# EAGLE design PGTN005_filter (EAGLE 9.6.0)
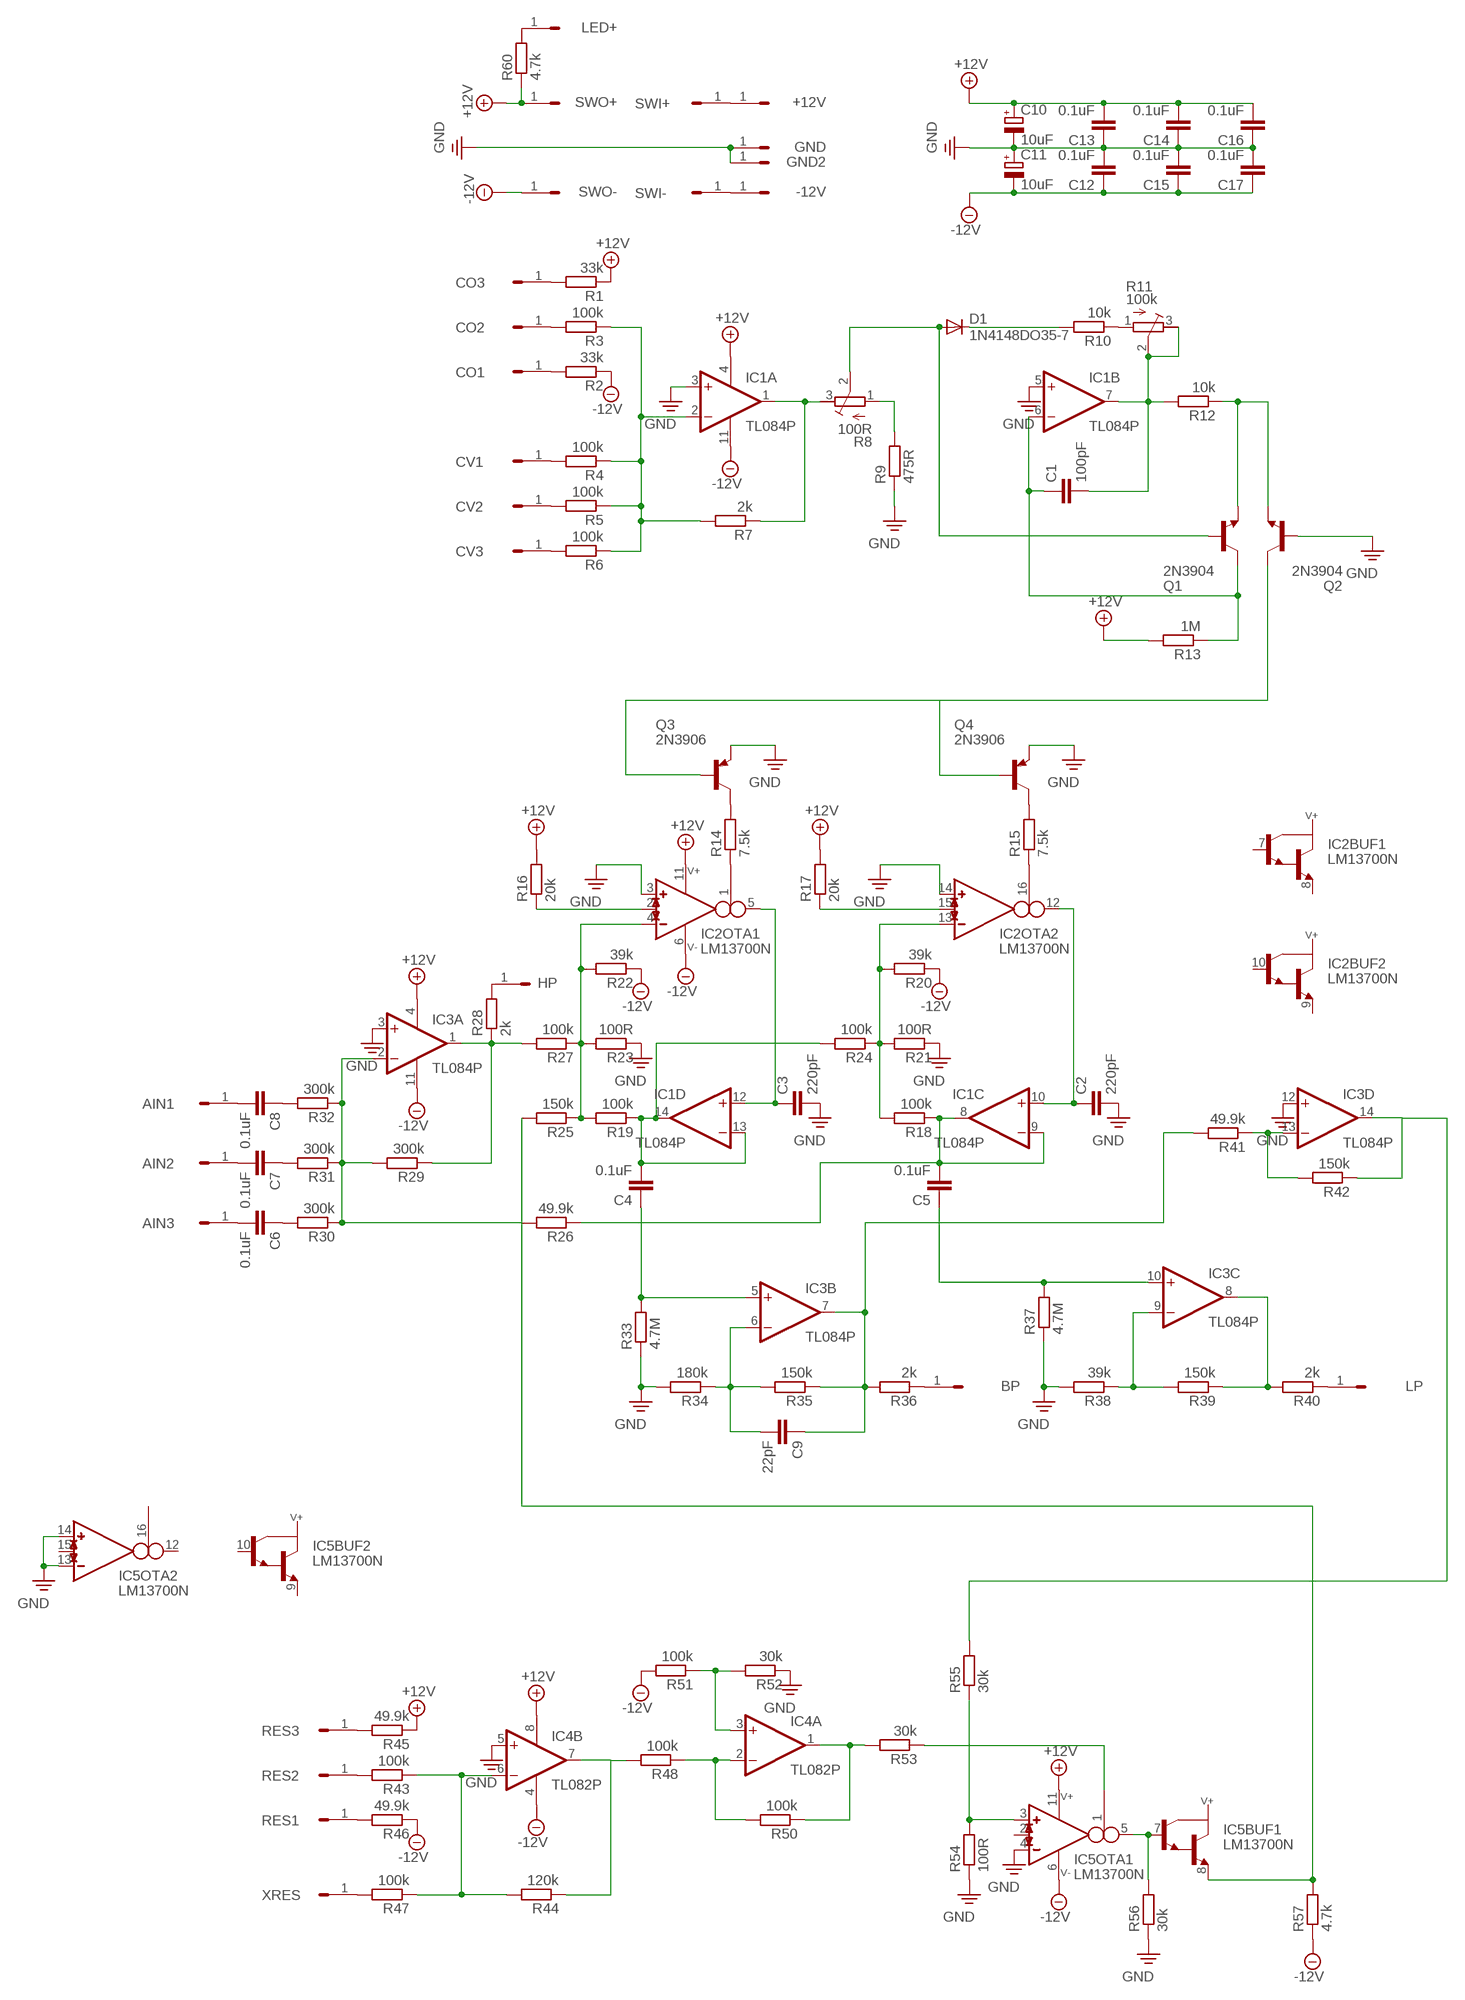
[diagram p0: schematic, sheet 1]

## Parts
+12V  HEADER/MALE/01  [HEADER/MALE/01]
-12V  HEADER/MALE/01  [HEADER/MALE/01]
AIN1  HEADER/MALE/01  [HEADER/MALE/01]
AIN2  HEADER/MALE/01  [HEADER/MALE/01]
AIN3  HEADER/MALE/01  [HEADER/MALE/01]
BP  HEADER/MALE/01  [HEADER/MALE/01]
C1  100pF  CAPACITORCERAMICDISC/5  [CERAMICDISC/5]
C2  220pF  CAPACITORCERAMICDISC/5  [CERAMICDISC/5]
C3  220pF  CAPACITORCERAMICDISC/5  [CERAMICDISC/5]
C4  0.1uF  CAPACITORCERAMICDISC/5  [CERAMICDISC/5]
C5  0.1uF  CAPACITORCERAMICDISC/5  [CERAMICDISC/5]
C6  0.1uF  CAPACITORCERAMICDISC/5  [CERAMICDISC/5]
C7  0.1uF  CAPACITORCERAMICDISC/5  [CERAMICDISC/5]
C8  0.1uF  CAPACITORCERAMICDISC/5  [CERAMICDISC/5]
C9  22pF  CAPACITORCERAMICDISC/5  [CERAMICDISC/5]
C10  10uF  CAPACITOR/POLARIZEDE2.5-6  [E2,5-6]
C11  10uF  CAPACITOR/POLARIZEDE2.5-6  [E2,5-6]
C12  0.1uF  CAPACITORCERAMICDISC/5  [CERAMICDISC/5]
C13  0.1uF  CAPACITORCERAMICDISC/5  [CERAMICDISC/5]
C14  0.1uF  CAPACITORCERAMICDISC/5  [CERAMICDISC/5]
C15  0.1uF  CAPACITORCERAMICDISC/5  [CERAMICDISC/5]
C16  0.1uF  CAPACITORCERAMICDISC/5  [CERAMICDISC/5]
C17  0.1uF  CAPACITORCERAMICDISC/5  [CERAMICDISC/5]
CO1  HEADER/MALE/01  [HEADER/MALE/01]
CO2  HEADER/MALE/01  [HEADER/MALE/01]
CO3  HEADER/MALE/01  [HEADER/MALE/01]
CV1  HEADER/MALE/01  [HEADER/MALE/01]
CV2  HEADER/MALE/01  [HEADER/MALE/01]
CV3  HEADER/MALE/01  [HEADER/MALE/01]
D1  1N4148DO35-7  [DO35-7]
GND  HEADER/MALE/01  [HEADER/MALE/01]
GND2  HEADER/MALE/01  [HEADER/MALE/01]
HP  HEADER/MALE/01  [HEADER/MALE/01]
IC1  TL084P  [DIL14]
IC2  LM13700N  [DIL16]
IC3  TL084P  [DIL14]
IC4  TL082P  [DIL08]
IC5  LM13700N  [DIL16]
LED+  HEADER/MALE/01  [HEADER/MALE/01]
LP  HEADER/MALE/01  [HEADER/MALE/01]
Q1  2N3904  [TO92]
Q2  2N3904  [TO92]
Q3  2N3906  [TO92]
Q4  2N3906  [TO92]
R1  33k  RESISTORRESISTOR/UPRIGHT/7.5  [RESISTOR/7.5]
R2  33k  RESISTORRESISTOR/UPRIGHT/7.5  [RESISTOR/7.5]
R3  100k  RESISTORRESISTOR/UPRIGHT/7.5  [RESISTOR/7.5]
R4  100k  RESISTORRESISTOR/UPRIGHT/7.5  [RESISTOR/7.5]
R5  100k  RESISTORRESISTOR/UPRIGHT/7.5  [RESISTOR/7.5]
R6  100k  RESISTORRESISTOR/UPRIGHT/7.5  [RESISTOR/7.5]
R7  2k  RESISTORRESISTOR/UPRIGHT/7.5  [RESISTOR/7.5]
R8  100R  TRIMMER64X  [TRIMMER/64B]
R9  475R  RESISTORRESISTOR/UPRIGHT/7.5  [RESISTOR/7.5]
R10  10k  RESISTORRESISTOR/UPRIGHT/7.5  [RESISTOR/7.5]
R11  100k  TRIMMER64X  [TRIMMER/64B]
R12  10k  RESISTORRESISTOR/UPRIGHT/7.5  [RESISTOR/7.5]
R13  1M  RESISTORRESISTOR/UPRIGHT/7.5  [RESISTOR/7.5]
R14  7.5k  RESISTORRESISTOR/UPRIGHT/7.5  [RESISTOR/7.5]
R15  7.5k  RESISTORRESISTOR/UPRIGHT/7.5  [RESISTOR/7.5]
R16  20k  RESISTORRESISTOR/UPRIGHT/7.5  [RESISTOR/7.5]
R17  20k  RESISTORRESISTOR/UPRIGHT/7.5  [RESISTOR/7.5]
R18  100k  RESISTORRESISTOR/UPRIGHT/7.5  [RESISTOR/7.5]
R19  100k  RESISTORRESISTOR/UPRIGHT/7.5  [RESISTOR/7.5]
R20  39k  RESISTORRESISTOR/UPRIGHT/7.5  [RESISTOR/7.5]
R21  100R  RESISTORRESISTOR/UPRIGHT/7.5  [RESISTOR/7.5]
R22  39k  RESISTORRESISTOR/UPRIGHT/7.5  [RESISTOR/7.5]
R23  100R  RESISTORRESISTOR/UPRIGHT/7.5  [RESISTOR/7.5]
R24  100k  RESISTORRESISTOR/UPRIGHT/7.5  [RESISTOR/7.5]
R25  150k  RESISTORRESISTOR/UPRIGHT/7.5  [RESISTOR/7.5]
R26  49.9k  RESISTORRESISTOR/UPRIGHT/7.5  [RESISTOR/7.5]
R27  100k  RESISTORRESISTOR/UPRIGHT/7.5  [RESISTOR/7.5]
R28  2k  RESISTORRESISTOR/UPRIGHT/7.5  [RESISTOR/7.5]
R29  300k  RESISTORRESISTOR/UPRIGHT/7.5  [RESISTOR/7.5]
R30  300k  RESISTORRESISTOR/UPRIGHT/7.5  [RESISTOR/7.5]
R31  300k  RESISTORRESISTOR/UPRIGHT/7.5  [RESISTOR/7.5]
R32  300k  RESISTORRESISTOR/UPRIGHT/7.5  [RESISTOR/7.5]
R33  4.7M  RESISTORRESISTOR/UPRIGHT/7.5  [RESISTOR/7.5]
R34  180k  RESISTORRESISTOR/UPRIGHT/7.5  [RESISTOR/7.5]
R35  150k  RESISTORRESISTOR/UPRIGHT/7.5  [RESISTOR/7.5]
R36  2k  RESISTORRESISTOR/UPRIGHT/7.5  [RESISTOR/7.5]
R37  4.7M  RESISTORRESISTOR/UPRIGHT/7.5  [RESISTOR/7.5]
R38  39k  RESISTORRESISTOR/UPRIGHT/7.5  [RESISTOR/7.5]
R39  150k  RESISTORRESISTOR/UPRIGHT/7.5  [RESISTOR/7.5]
R40  2k  RESISTORRESISTOR/UPRIGHT/7.5  [RESISTOR/7.5]
R41  49.9k  RESISTORRESISTOR/UPRIGHT/7.5  [RESISTOR/7.5]
R42  150k  RESISTORRESISTOR/UPRIGHT/7.5  [RESISTOR/7.5]
R43  100k  RESISTORRESISTOR/UPRIGHT/7.5  [RESISTOR/7.5]
R44  120k  RESISTORRESISTOR/UPRIGHT/7.5  [RESISTOR/7.5]
R45  49.9k  RESISTORRESISTOR/UPRIGHT/7.5  [RESISTOR/7.5]
R46  49.9k  RESISTORRESISTOR/UPRIGHT/7.5  [RESISTOR/7.5]
R47  100k  RESISTORRESISTOR/UPRIGHT/7.5  [RESISTOR/7.5]
R48  100k  RESISTORRESISTOR/UPRIGHT/7.5  [RESISTOR/7.5]
R50  100k  RESISTORRESISTOR/UPRIGHT/7.5  [RESISTOR/7.5]
R51  100k  RESISTORRESISTOR/UPRIGHT/7.5  [RESISTOR/7.5]
R52  30k  RESISTORRESISTOR/UPRIGHT/7.5  [RESISTOR/7.5]
R53  30k  RESISTORRESISTOR/UPRIGHT/7.5  [RESISTOR/7.5]
R54  100R  RESISTORRESISTOR/UPRIGHT/7.5  [RESISTOR/7.5]
R55  30k  RESISTORRESISTOR/UPRIGHT/7.5  [RESISTOR/7.5]
R56  30k  RESISTORRESISTOR/UPRIGHT/7.5  [RESISTOR/7.5]
R57  4.7k  RESISTORRESISTOR/UPRIGHT/7.5  [RESISTOR/7.5]
R60  4.7k  RESISTORRESISTOR/UPRIGHT/7.5  [RESISTOR/7.5]
RES1  HEADER/MALE/01  [HEADER/MALE/01]
RES2  HEADER/MALE/01  [HEADER/MALE/01]
RES3  HEADER/MALE/01  [HEADER/MALE/01]
SWI+  HEADER/MALE/01  [HEADER/MALE/01]
SWI-  HEADER/MALE/01  [HEADER/MALE/01]
SWO+  HEADER/MALE/01  [HEADER/MALE/01]
SWO-  HEADER/MALE/01  [HEADER/MALE/01]
XRES  HEADER/MALE/01  [HEADER/MALE/01]

## Nets
+12V: C10.+ C13.2 C14.2 C16.2 IC1.4(P:V+) IC2.11(SUPPLY:V+) IC3.4(P:V+) IC4.8(P:V+) IC5.11(SUPPLY:V+) R1.1 R13.2 R16.2 R17.2 R45.1 R60.1 SWO+.1
-12V: C11.- C12.1 C15.1 C17.1 IC1.11(P:V-) IC2.6(SUPPLY:V-) IC3.11(P:V-) IC4.4(P:V-) IC5.6(SUPPLY:V-) R2.1 R20.1 R22.1 R46.1 R51.2 R57.1 SWO-.1
N$1: CO3.1 R1.2
N$2: CO1.1 R2.2
N$3: CO2.1 R3.2
N$4: IC1.2(A:-IN) R3.1 R4.1 R5.1 R6.1 R7.2
N$5: CV1.1 R4.2
N$6: CV2.1 R5.2
N$7: CV3.1 R6.2
N$8: IC1.1(A:OUT) R7.1 R8.3(A)
N$9: R8.1(E) R9.2
N$10: D1.A Q1.2(B) R8.2(S)
N$11: D1.C R10.2
N$12: R10.1 R11.1(E)
N$13: C1.2 IC1.7(B:OUT) R11.2(S) R11.3(A) R12.2
N$14: C1.1 IC1.6(B:-IN) Q1.1(C) R13.1
N$15: Q1.3(E) Q2.3(E) R12.1
N$16: Q2.1(C) Q3.2(B) Q4.2(B)
N$17: Q3.1(C) R14.2
N$18: Q4.1(C) R15.2
N$19: IC2.1(OTA1:I_BIAS) R14.1
N$20: IC2.16(OTA2:I_BIAS) R15.1
N$21: IC2.2(OTA1:I_DIODE) R16.1
N$22: IC2.15(OTA2:I_DIODE) R17.1
N$23: C2.1 IC1.10(C:+IN) IC2.12(OTA2:OUT)
N$24: C3.1 IC1.12(D:+IN) IC2.5(OTA1:OUT)
N$25: C5.2 IC1.8(C:OUT) IC1.9(C:-IN) R18.1 R26.1
N$26: C4.2 IC1.13(D:-IN) IC1.14(D:OUT) R19.1 R24.2
N$27: IC2.13(OTA2:IN_N) R18.2 R20.2 R21.2 R24.1
N$28: IC2.4(OTA1:IN_N) R19.2 R22.2 R23.2 R25.1 R27.1
N$29: IC3.1(A:OUT) R27.2 R28.1 R29.1
N$30: IC3.2(A:-IN) R26.2 R29.2 R30.1 R31.1 R32.1
N$31: HP.1 R28.2
N$32: C6.1 R30.2
N$33: C7.1 R31.2
N$34: C8.1 R32.2
N$35: AIN1.1 C8.2
N$36: AIN2.1 C7.2
N$37: AIN3.1 C6.2
N$38: C4.1 IC3.5(B:+IN) R33.2
N$39: C9.2 IC3.6(B:-IN) R34.1 R35.2
N$40: C9.1 IC3.7(B:OUT) R35.1 R36.2 R41.2
N$41: BP.1 R36.1
N$42: C5.1 IC3.10(C:+IN) R37.2
N$43: R45.2 RES3.1
N$44: IC3.9(C:-IN) R38.1 R39.2
N$45: IC3.8(C:OUT) R39.1 R40.2
N$46: LP.1 R40.1
N$47: IC3.13(D:-IN) R41.1 R42.2
N$48: IC3.14(D:OUT) R42.1 R55.2
N$49: IC5.8(BUF1:E) R25.2 R57.2
N$50: IC4.6(B:-IN) R43.1 R44.2 R47.1
N$51: IC4.7(B:OUT) R44.1 R48.2
N$52: R43.2 RES2.1
N$53: R46.2 RES1.1
N$54: R47.2 XRES.1
N$55: IC4.1(A:OUT) R50.1 R53.2
N$56: IC4.2(A:-IN) R48.1 R50.2
N$57: IC4.3(A:+IN) R51.1 R52.2
N$58: IC5.1(OTA1:I_BIAS) R53.1
N$59: IC5.3(OTA1:IN_P) R54.2 R55.1
N$61: IC5.5(OTA1:OUT) IC5.7(BUF1:B) R56.2
N$66: +12V.1 SWI+.1
N$67: -12V.1 SWI-.1
N$68: LED+.1 R60.2
PE: C2.2 C3.2 C10.- C11.+ C12.2 C13.1 C14.1 C15.2 C16.1 C17.2 GND2.1 GND.1 IC1.3(A:+IN) IC1.5(B:+IN) IC2.3(OTA1:IN_P) IC2.14(OTA2:IN_P) IC3.3(A:+IN) IC3.12(D:+IN) IC4.5(B:+IN) IC5.4(OTA1:IN_N) IC5.13(OTA2:IN_N) IC5.14(OTA2:IN_P) Q2.2(B) Q3.3(E) Q4.3(E) R9.1 R21.1 R23.1 R33.1 R34.2 R37.1 R38.2 R52.1 R54.1 R56.1 ; supply symbol labelled GND
Unconnected: IC2.7(BUF1:B) IC2.8(BUF1:E) IC2.9(BUF2:E) IC2.10(BUF2:B) IC5.2(OTA1:I_DIODE) IC5.9(BUF2:E) IC5.10(BUF2:B) IC5.12(OTA2:OUT) IC5.15(OTA2:I_DIODE) IC5.16(OTA2:I_BIAS)

## Library data of the parts
+12V -12V AIN1-AIN3 BP CO1-CO3 CV1-CV3 GND GND2 HP LED+ LP RES1-RES3 SWI+ SWI- SWO+ SWO- XRES = connectors:HEADER/MALE/01
C1-C9 C12-C17 = capacitors:CAPACITOR: CAPACITOR, European symbol
C10 C11 = capacitors:CAPACITOR/POLARIZED: POLARIZED CAPACITOR, European symbol
D1 = transistors:1N4148: DIODE high speed (Philips)
IC1 IC3 = ic_analogue:TL084: OP AMP
IC2 IC5 = ic_analogue:LM13700: Dual OTA with buffers
IC4 = ic_analogue:TL082: OP AMP
Q1 Q2 = transistors:2N3904: NPN Transistor
Q3 Q4 = transistors:2N3906: PNP Transistor
R1-R7 R9 R10 R12-R48 R50-R57 R60 = resistors:RESISTOR: RESISTOR, European symbol
R8 R11 = resistors:TRIMMER: Trimm resistor

## Board
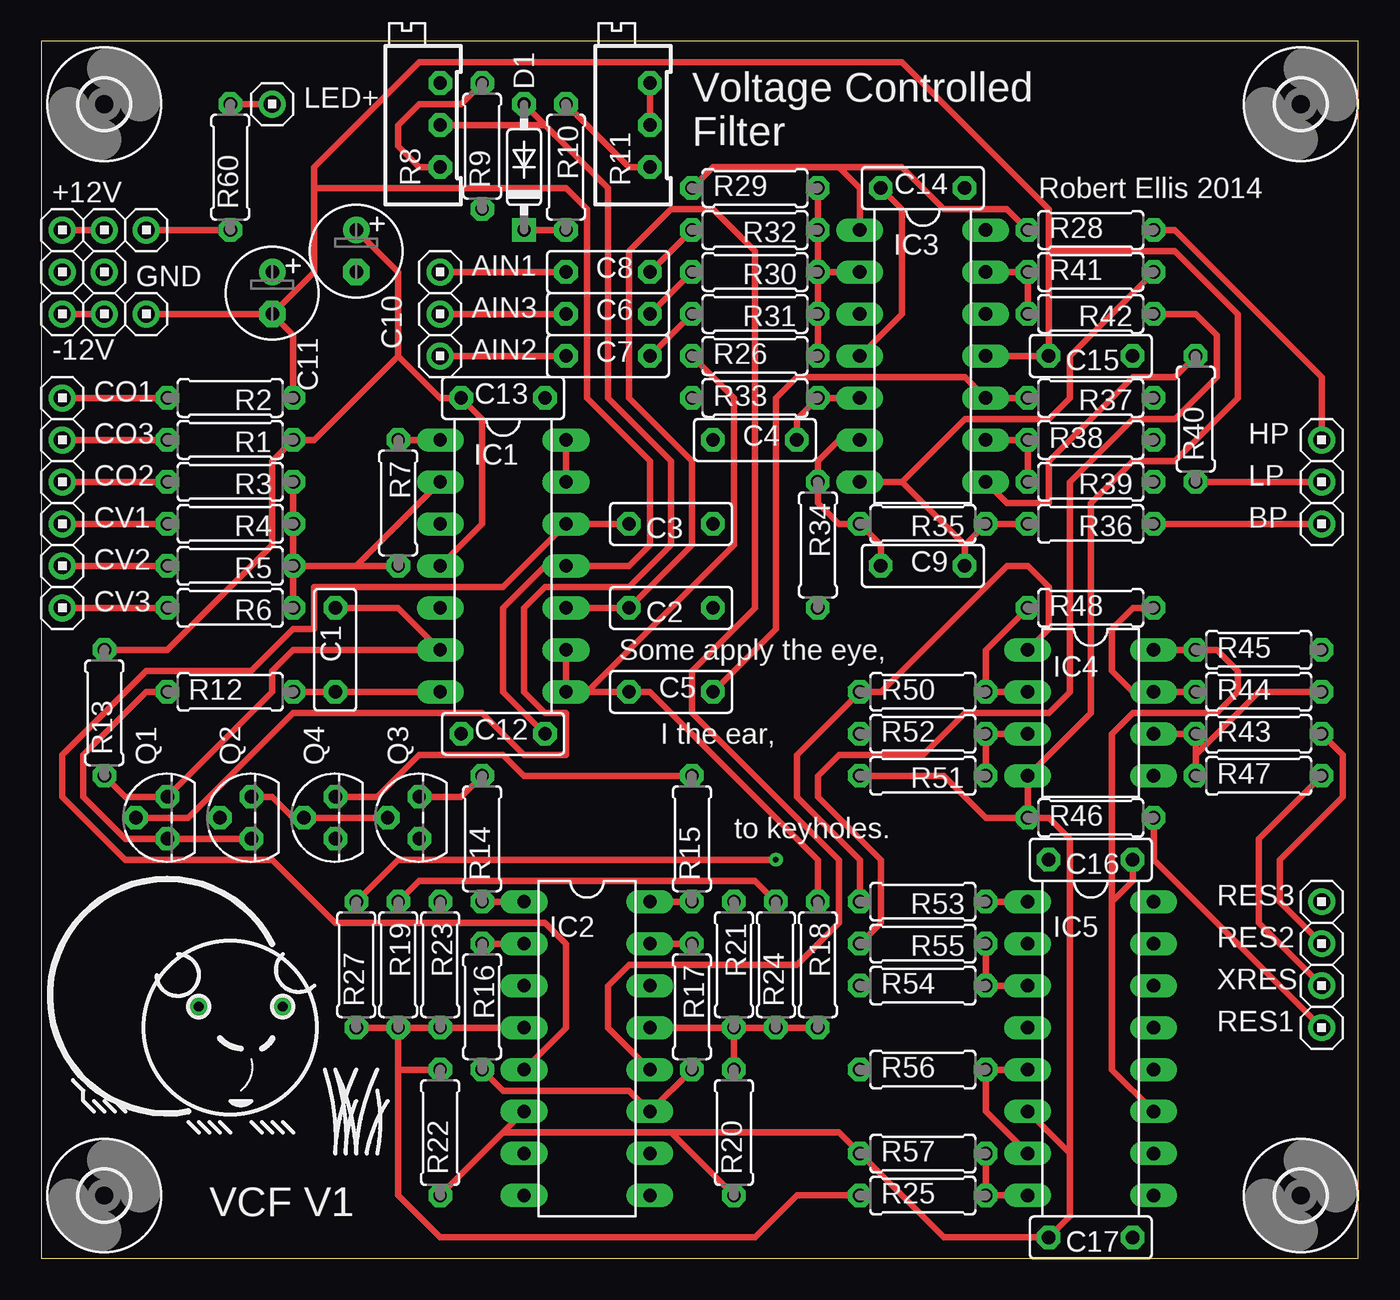
[diagram p1: board, top side]
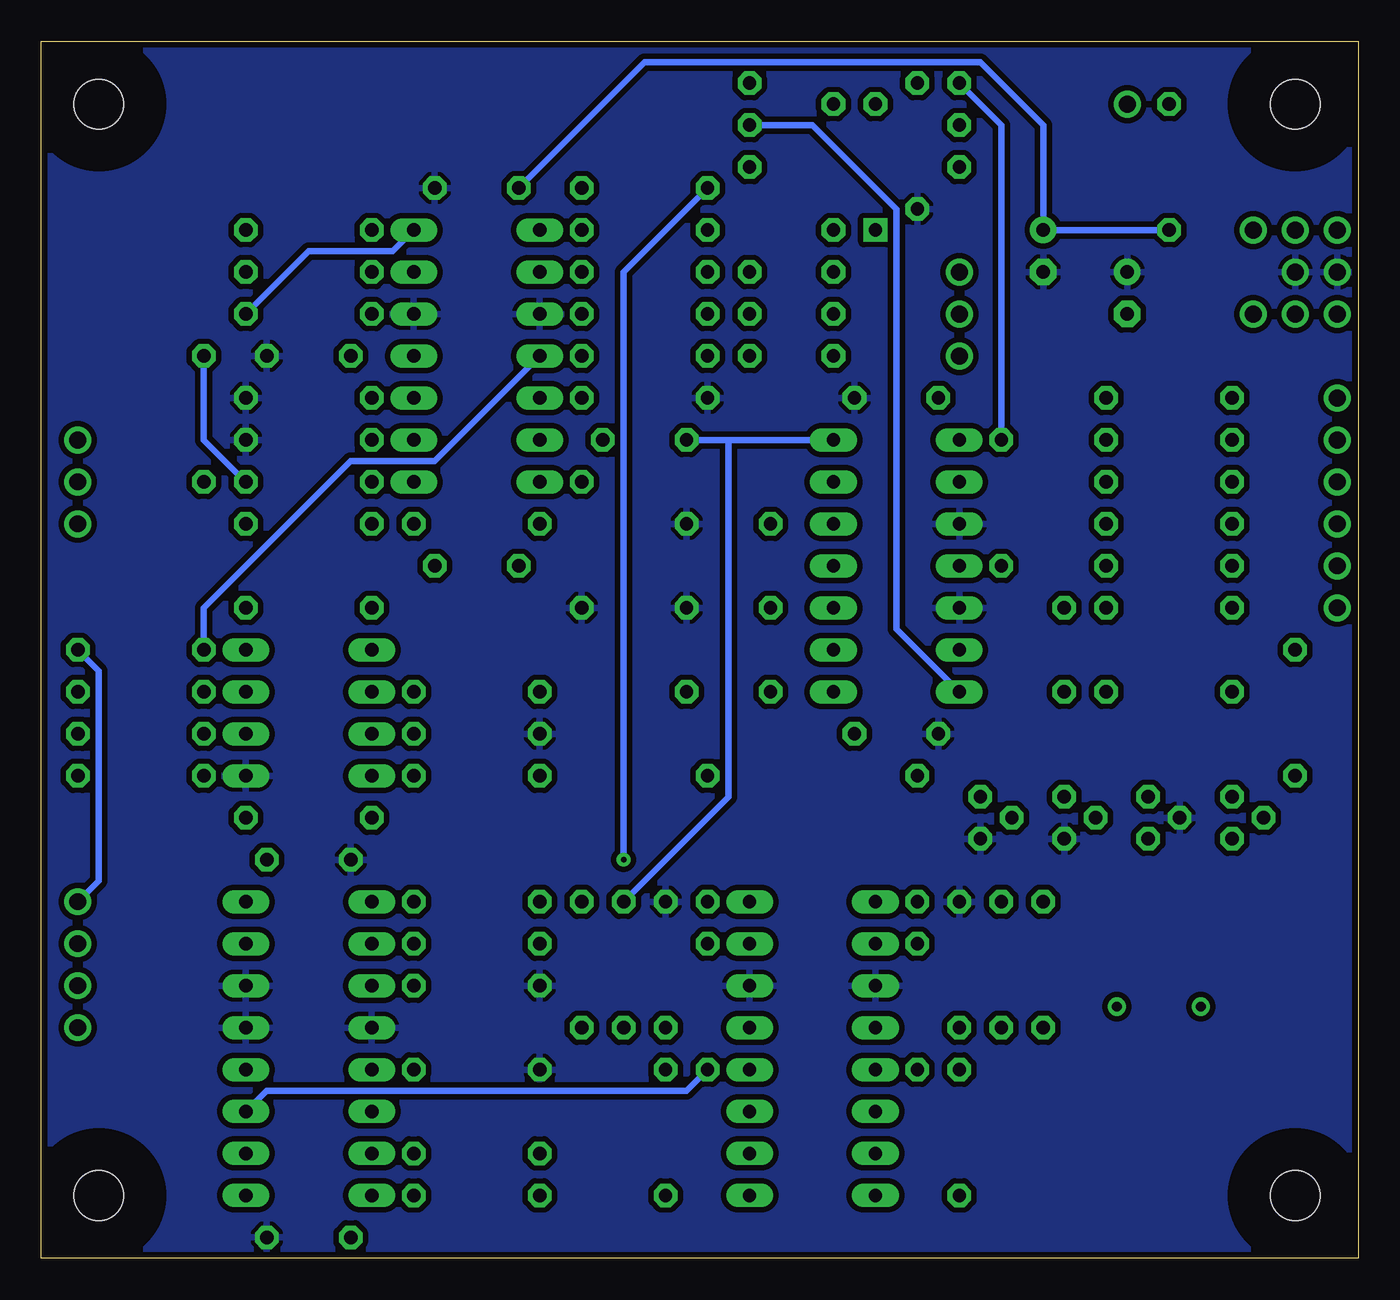
[diagram p2: board, bottom side, seen from below]

Size 79.68 x 73.65 mm. Coordinates in mm from the lower left corner, seen from the top.
Outline: 0,0 79.68,0 79.68,73.65 0,73.65 0,0
Copper layers (1*16): Top 0.0356mm / dielectric 1.5011mm / Bottom 0.0356mm
Design rules "rob": minimum track width 16mil, minimum drill 13mil, track to track 13mil, track to pad 13mil, pad to pad 13mil, via to via 13mil, smd to smd 6mil, copper to edge 15mil, drill to drill 10mil, minimum pad ring 12mil, minimum via ring 10mil, stop-mask expansion 4mil, vias tented up to drill 0mil, thermal gap 10mil

### Footprints (pad centres in the part's own frame; a part is rotated, then mirrored left to right if it is on the bottom)
HEADER/MALE/01 = drill 1.016: 1 0,0
CERAMICDISC/5 = drill 0.813 octagon: 1 -2.54,0; 2 2.54,0
E2,5-6 = drill 0.813 pad 1.6: + -1.27,0 | drill 0.813 pad 1.6 octagon: - 1.27,0
DO35-7 = drill 0.813 octagon: A 3.81,0 | drill 0.813 square: C -3.81,0
DIL14 = drill 0.813 long: 1 -7.62,-3.81; 2 -5.08,-3.81; 3 -2.54,-3.81; 4 0,-3.81; 5 2.54,-3.81; 6 5.08,-3.81; 7 7.62,-3.81; 8 7.62,3.81; 9 5.08,3.81; 10 2.54,3.81; 11 0,3.81; 12 -2.54,3.81; 13 -5.08,3.81; 14 -7.62,3.81
DIL16 = drill 0.813 long: 1 -8.89,-3.81; 2 -6.35,-3.81; 3 -3.81,-3.81; 4 -1.27,-3.81; 5 1.27,-3.81; 6 3.81,-3.81; 7 6.35,-3.81; 8 8.89,-3.81; 9 8.89,3.81; 10 6.35,3.81; 11 3.81,3.81; 12 1.27,3.81; 13 -1.27,3.81; 14 -3.81,3.81; 15 -6.35,3.81; 16 -8.89,3.81
DIL08 = drill 0.813 pad 1.27 long: 1 -3.81,-3.81; 2 -1.27,-3.81; 3 1.27,-3.81; 4 3.81,-3.81; 5 3.81,3.81; 6 1.27,3.81; 7 -1.27,3.81; 8 -3.81,3.81
TO92 = drill 0.813 octagon: 1 1.27,0; 2 0,1.905; 3 -1.27,0
RESISTOR/7.5 = drill 0.813 octagon: 1 -3.81,0; 2 3.81,0
TRIMMER/64B = drill 0.813 octagon: 1 1.27,-2.54; 2 1.27,0; 3 1.27,2.54
STANDOFF/3.0 = hole 3: 0,0

### Placement (x,y rotation side)
+12V  1.27,62.23 0 top
-12V  1.27,57.15 0 top
AIN1  24.13,59.69 0 top
AIN2  24.13,54.61 0 top
AIN3  24.13,57.15 0 top
BP  77.47,44.45 0 top
C1  17.78,36.83 270 top
C2  38.1,39.37 0 top
C3  38.1,44.45 0 top
C4  43.18,49.53 180 top
C5  38.1,34.29 180 top
C6  34.29,57.15 180 top
C7  34.29,54.61 180 top
C8  34.29,59.69 180 top
C9  53.34,41.91 180 top
C10  19.05,60.96 270 top
C11  13.97,58.42 270 top
C12  27.94,31.75 180 top
C13  27.94,52.07 180 top
C14  53.34,64.77 180 top
C15  63.5,54.61 0 top
C16  63.5,24.13 0 top
C17  63.5,1.27 0 top
CO1  1.27,52.07 0 top
CO2  1.27,46.99 0 top
CO3  1.27,49.53 0 top
CV1  1.27,44.45 0 top
CV2  1.27,41.91 0 top
CV3  1.27,39.37 0 top
D1  29.21,66.04 90 top
GND  1.27,59.69 0 top
GND2  3.81,59.69 0 top
HP  77.47,49.53 0 top
IC1  27.94,41.91 270 top
IC2  33.02,12.7 270 top
IC3  53.34,54.61 270 top
IC4  63.5,33.02 270 top
IC5  63.5,12.7 270 top
LED+  13.97,69.85 0 top
LP  77.47,46.99 0 top
Q1  7.62,26.67 90 top
Q2  12.7,26.67 90 top
Q3  22.86,26.67 90 top
Q4  17.78,26.67 90 top
R1  11.43,49.53 180 top
R2  11.43,52.07 180 top
R3  11.43,46.99 180 top
R4  11.43,44.45 180 top
R5  11.43,41.91 180 top
R6  11.43,39.37 180 top
R7  21.59,45.72 270 top
R8  22.86,68.58 0 top
R9  26.67,67.31 90 top
R10  31.75,66.04 270 top
R11  35.56,68.58 0 top
R12  11.43,34.29 0 top
R13  3.81,33.02 90 top
R14  26.67,25.4 90 top
R15  39.37,25.4 90 top
R16  26.67,15.24 270 top
R17  39.37,15.24 270 top
R18  46.99,17.78 270 top
R19  21.59,17.78 270 top
R20  41.91,7.62 90 top
R21  41.91,17.78 270 top
R22  24.13,7.62 90 top
R23  24.13,17.78 270 top
R24  44.45,17.78 90 top
R25  53.34,3.81 0 top
R26  43.18,54.61 0 top
R27  19.05,17.78 90 top
R28  63.5,62.23 0 top
R29  43.18,64.77 0 top
R30  43.18,59.69 180 top
R31  43.18,57.15 180 top
R32  43.18,62.23 180 top
R33  43.18,52.07 0 top
R34  46.99,43.18 270 top
R35  53.34,44.45 180 top
R36  63.5,44.45 180 top
R37  63.5,52.07 180 top
R38  63.5,49.53 0 top
R39  63.5,46.99 180 top
R40  69.85,50.8 90 top
R41  63.5,59.69 0 top
R42  63.5,57.15 180 top
R43  73.66,31.75 0 top
R44  73.66,34.29 0 top
R45  73.66,36.83 0 top
R46  63.5,26.67 0 top
R47  73.66,29.21 0 top
R48  63.5,39.37 0 top
R50  53.34,34.29 0 top
R51  53.34,29.21 180 top
R52  53.34,31.75 0 top
R53  53.34,21.59 180 top
R54  53.34,16.51 0 top
R55  53.34,19.05 180 top
R56  53.34,11.43 0 top
R57  53.34,6.35 0 top
R60  11.43,66.04 90 top
RES1  77.47,13.97 0 top
RES2  77.47,19.05 0 top
RES3  77.47,21.59 0 top
SWI+  3.81,62.23 0 top
SWI-  3.81,57.15 0 top
SWO+  6.35,62.23 0 top
SWO-  6.35,57.15 0 top
U$1  [STANDOFF/3.0]  3.81,69.85 0 top
U$2  [STANDOFF/3.0]  3.81,3.81 0 top
U$3  [STANDOFF/3.0]  76.2,69.85 0 top
U$4  [STANDOFF/3.0]  76.2,3.81 0 top
XRES  77.47,16.51 0 top

### Tracks (layer width: path | path; a pad name or v marks a point on that pad's centre or on a via)
+12V
  Top 0.406: IC4.8 R45.1 71.12,36.83 72.39,35.56 72.39,34.29 71.12,33.02 66.04,33.02 64.77,31.75 64.77,21.59 | C16.2 66.04,22.86 64.77,21.59 | 64.77,21.59 64.77,11.43 IC5.11 | R16.2 27.94,10.16 35.56,10.16 IC2.11 R17.2 | R13.2 7.62,36.83 13.97,43.18 13.97,48.26 R1.1 16.51,49.53 21.59,54.61 | SWO+.1 R60.1 | IC3.4 52.07,57.15 52.07,63.5 C14.2 | IC1.4 26.67,44.45 26.67,50.8 C13.2 24.13,52.07 21.59,54.61 | C10.+ 21.59,59.69 21.59,54.61
  Bottom 0.406: R60.1 C10.+ 19.05,68.58 22.86,72.39 43.18,72.39 C14.2 | IC3.4 55.88,48.26 60.96,48.26 69.85,39.37 R45.1 | R17.2 40.64,10.16 66.04,10.16 IC5.11
-12V
  Top 0.406: R51.2 54.61,29.21 57.15,26.67 R46.1 | R46.1 IC4.4 63.5,33.02 63.5,45.72 66.04,48.26 68.58,48.26 72.39,52.07 72.39,57.15 68.58,60.96 60.96,60.96 | IC2.6 27.94,7.62 | 27.94,7.62 R22.1 | 38.1,7.62 R20.1 | 27.94,7.62 38.1,7.62 | 62.23,6.35 IC5.6 | 62.23,6.35 62.23,2.54 C17.1 54.61,1.27 R57.1 48.26,7.62 38.1,7.62 | R46.1 60.96,26.67 62.23,25.4 62.23,6.35 | C12.1 27.94,34.29 27.94,39.37 30.48,41.91 IC1.11 35.56,41.91 36.83,43.18 36.83,48.26 33.02,52.07 33.02,63.5 31.75,64.77 16.51,64.77 | IC3.11 C15.1 60.96,60.96 | R2.1 15.24,55.88 C11.- | C11.- SWO-.1 | 60.96,60.96 60.96,63.5 52.07,72.39 22.86,72.39 16.51,66.04 16.51,64.77 | 16.51,64.77 16.51,59.69 C11.-
N$1
  Top 0.406: CO3.1 R1.2
N$2
  Top 0.406: CO1.1 R2.2
N$3
  Top 0.406: CO2.1 R3.2
N$4
  Top 0.406: R3.1 R4.1 R5.1 | R5.1 R6.1 | R5.1 19.05,41.91 | 19.05,41.91 R7.2 | 19.05,41.91 IC1.2
N$5
  Top 0.406: CV1.1 R4.2
N$6
  Top 0.406: CV2.1 R5.2
N$7
  Top 0.406: CV3.1 R6.2
N$8
  Top 0.406: IC1.1 R7.1
  Bottom 0.406: R8.3 21.59,68.58 R7.1
N$9
  Top 0.406: R9.2 25.4,69.85 22.86,69.85 21.59,68.58 21.59,67.31 22.86,66.04 R8.1
N$10
  Top 0.406: Q1.2 8.89,26.67 15.24,33.02 26.67,33.02 29.21,30.48 31.75,30.48 31.75,33.02 30.48,33.02 29.21,34.29 29.21,39.37 30.48,40.64 35.56,40.64 38.1,43.18 38.1,48.26 34.29,52.07 34.29,64.77 30.48,68.58 | D1.A 30.48,68.58 | 30.48,68.58 R8.2
N$11
  Top 0.406: R10.2 D1.C
N$12
  Top 0.406: R10.1 35.56,66.04 R11.1
N$13
  Top 0.406: R12.2 C1.2 IC1.7 | R11.3 R11.2
  Bottom 0.406: R11.2 33.02,68.58 27.94,63.5 27.94,38.1 IC1.7
N$14
  Top 0.406: R13.1 5.08,27.94 Q1.1 13.97,34.29 13.97,35.56 15.24,36.83 IC1.6 21.59,39.37 C1.1
N$15
  Top 0.406: Q2.3 Q1.3 5.08,25.4 2.54,27.94 2.54,30.48 6.35,34.29 R12.1
N$16
  Top 0.406: Q2.1 13.97,27.94 15.24,26.67 Q4.2 Q3.2
N$17
  Top 0.406: Q3.1 25.4,27.94 R14.2
N$18
  Top 0.406: Q4.1 20.32,27.94 22.86,30.48 27.94,30.48 29.21,29.21 R15.2
N$19
  Top 0.406: IC2.1 R14.1
N$20
  Top 0.406: R15.1 IC2.16
N$21
  Top 0.406: IC2.2 R16.1
N$22
  Top 0.406: R17.1 IC2.15
N$23
  Top 0.406: IC1.10 C2.1 39.37,43.18 39.37,48.26 35.56,52.07 35.56,60.96 38.1,63.5 40.64,63.5 43.18,60.96 43.18,39.37 39.37,35.56 39.37,33.02 48.26,24.13 48.26,20.32 45.72,17.78 35.56,17.78 34.29,16.51 34.29,13.97 IC2.12
N$24
  Top 0.406: IC2.5 31.75,13.97 31.75,19.05 30.48,20.32 17.78,20.32 13.97,24.13 5.08,24.13 1.27,27.94 1.27,30.48 6.35,35.56 12.7,35.56 15.24,38.1 16.51,38.1 16.51,40.64 27.94,40.64 IC1.12 C3.1
N$25
  Top 0.406: IC1.9 IC1.8 33.02,34.29 | 33.02,34.29 C5.2 36.83,34.29 46.99,24.13 R18.1 | R26.1 41.91,52.07 41.91,43.18 33.02,34.29
N$26
  Top 0.406: R19.1 22.86,22.86 43.18,22.86 R24.2 | IC1.14 IC1.13
  Bottom 0.406: IC1.14 38.1,49.53 | 38.1,49.53 C4.2 | 38.1,49.53 38.1,27.94 R24.2
N$27
  Top 0.406: R21.2 R20.2 | R21.2 IC2.13 | R21.2 R24.1 R18.2
N$28
  Top 0.406: R19.2 R27.1 | R25.1 45.72,3.81 43.18,1.27 24.13,1.27 21.59,3.81 21.59,11.43 | R19.2 21.59,11.43 | 21.59,11.43 R22.2 | R19.2 R23.2 IC2.4
N$29  (via drill 0.33)
  Top 0.406: IC3.1 49.53,64.77 48.26,66.04 | 48.26,66.04 40.64,66.04 R29.1 | R28.1 58.42,63.5 54.61,63.5 52.07,66.04 48.26,66.04 | R27.2 21.59,24.13 v44.45,24.13
  Bottom 0.406: v44.45,24.13 44.45,59.69 R29.1
N$30
  Top 0.406: R26.2 R31.1 R30.1 | R30.1 R32.1 R29.2 | R30.1 IC3.2
N$31
  Top 0.406: R28.2 68.58,62.23 77.47,53.34 HP.1
N$32
  Top 0.406: R30.2 C6.1
N$33
  Top 0.406: R31.2 C7.1
N$34
  Top 0.406: R32.2 C8.1
N$35
  Top 0.406: AIN1.1 C8.2
N$36
  Top 0.406: AIN2.1 C7.2
N$37
  Top 0.406: AIN3.1 C6.2
N$38
  Top 0.406: C4.1 45.72,50.8 R33.2 IC3.5
N$39
  Top 0.406: C9.2 50.8,43.18 R35.2 48.26,44.45 46.99,45.72 R34.1 46.99,48.26 48.26,49.53 IC3.6
N$40
  Top 0.406: 55.88,43.18 C9.1 | 55.88,43.18 R35.1 R36.2 | 52.07,46.99 IC3.7 | 55.88,43.18 52.07,46.99 | R41.2 62.23,54.61 62.23,52.07 60.96,50.8 55.88,50.8 52.07,46.99
N$41
  Top 0.406: BP.1 R36.1
N$42
  Top 0.406: C5.1 44.45,38.1 44.45,52.07 45.72,53.34 55.88,53.34 IC3.10 R37.2
N$43
  Bottom 0.406: R45.2 76.2,35.56 76.2,22.86 RES3.1
N$44
  Top 0.406: R39.2 R38.1 IC3.9
N$45
  Top 0.406: IC3.8 58.42,45.72 60.96,45.72 60.96,48.26 66.04,53.34 68.58,53.34 R40.2
  Bottom 0.406: R39.1 69.85,49.53 R40.2
N$46
  Top 0.406: LP.1 R40.1
N$47
  Top 0.406: R42.2 R41.1 IC3.13
N$48
  Top 0.406: R55.2 50.8,20.32 50.8,24.13 46.99,27.94 46.99,29.21 48.26,30.48 53.34,30.48 55.88,33.02 60.96,33.02 62.23,34.29 62.23,46.99 66.04,50.8 68.58,50.8 71.12,53.34 71.12,55.88 69.85,57.15 R42.1
  Bottom 0.406: IC3.14 58.42,60.96 63.5,60.96 R42.1
N$49
  Top 0.406: R57.2 R25.2 IC5.8
N$50
  Top 0.406: 69.85,30.48 R43.1 IC4.6 | 69.85,30.48 R47.1 | R44.2 73.66,34.29 69.85,30.48
N$51
  Top 0.406: R44.1 IC4.7 66.04,34.29 64.77,35.56 64.77,38.1 66.04,39.37 R48.2
N$52
  Top 0.406: R43.2 78.74,30.48 78.74,27.94 74.93,24.13 74.93,21.59 RES2.1
N$53
  Top 0.406: R46.2 67.31,24.13 RES1.1
N$54
  Top 0.406: XRES.1 73.66,20.32 73.66,25.4 R47.2
N$55
  Top 0.406: IC4.1 60.96,38.1 60.96,40.64 59.69,41.91 58.42,41.91 50.8,34.29 R50.1 45.72,30.48 45.72,27.94 49.53,24.13 R53.2
N$56
  Top 0.406: IC4.2 R50.2 57.15,36.83 R48.1
N$57
  Top 0.406: R51.1 R52.2 IC4.3
N$58
  Top 0.406: IC5.1 R53.1
N$59
  Top 0.406: R55.1 R54.2 IC5.3
N$60  (via drill 0.6)
  other vias: 9.53,15.24
N$61
  Top 0.406: IC5.7 57.15,8.89 R56.2 IC5.5
N$62  (via drill 0.6)
  other vias: 14.61,15.24
N$66
  Top 0.406: SWI+.1 +12V.1
N$67
  Top 0.406: SWI-.1 -12V.1
N$68
  Top 0.406: LED+.1 R60.2
PE
  pour Bottom: 0,73.66 80.01,73.66 80.01,0 0,0

### Text on the board
tNames: Voltage Controlled / Filter | Robert Ellis 2014 | Some apply the eye, | I the ear, | to keyholes. | VCF V1